# Altium schematic sheet [3] Power Supply.SchDoc: ARS Camera REV01 Power Supply
size A4; DrawnBy: Manh Ngo Van; Engineer: Manh Ngo Van; Organization: Altium Limited; Address1: L3, 12a Rodborough Rd; Address2: Frenchs Forest; Address3: NSW; Address4: Australia 2086; DocumentNumber: 3; Revision: 1.0; SheetNumber: 3; SheetTotal: 16
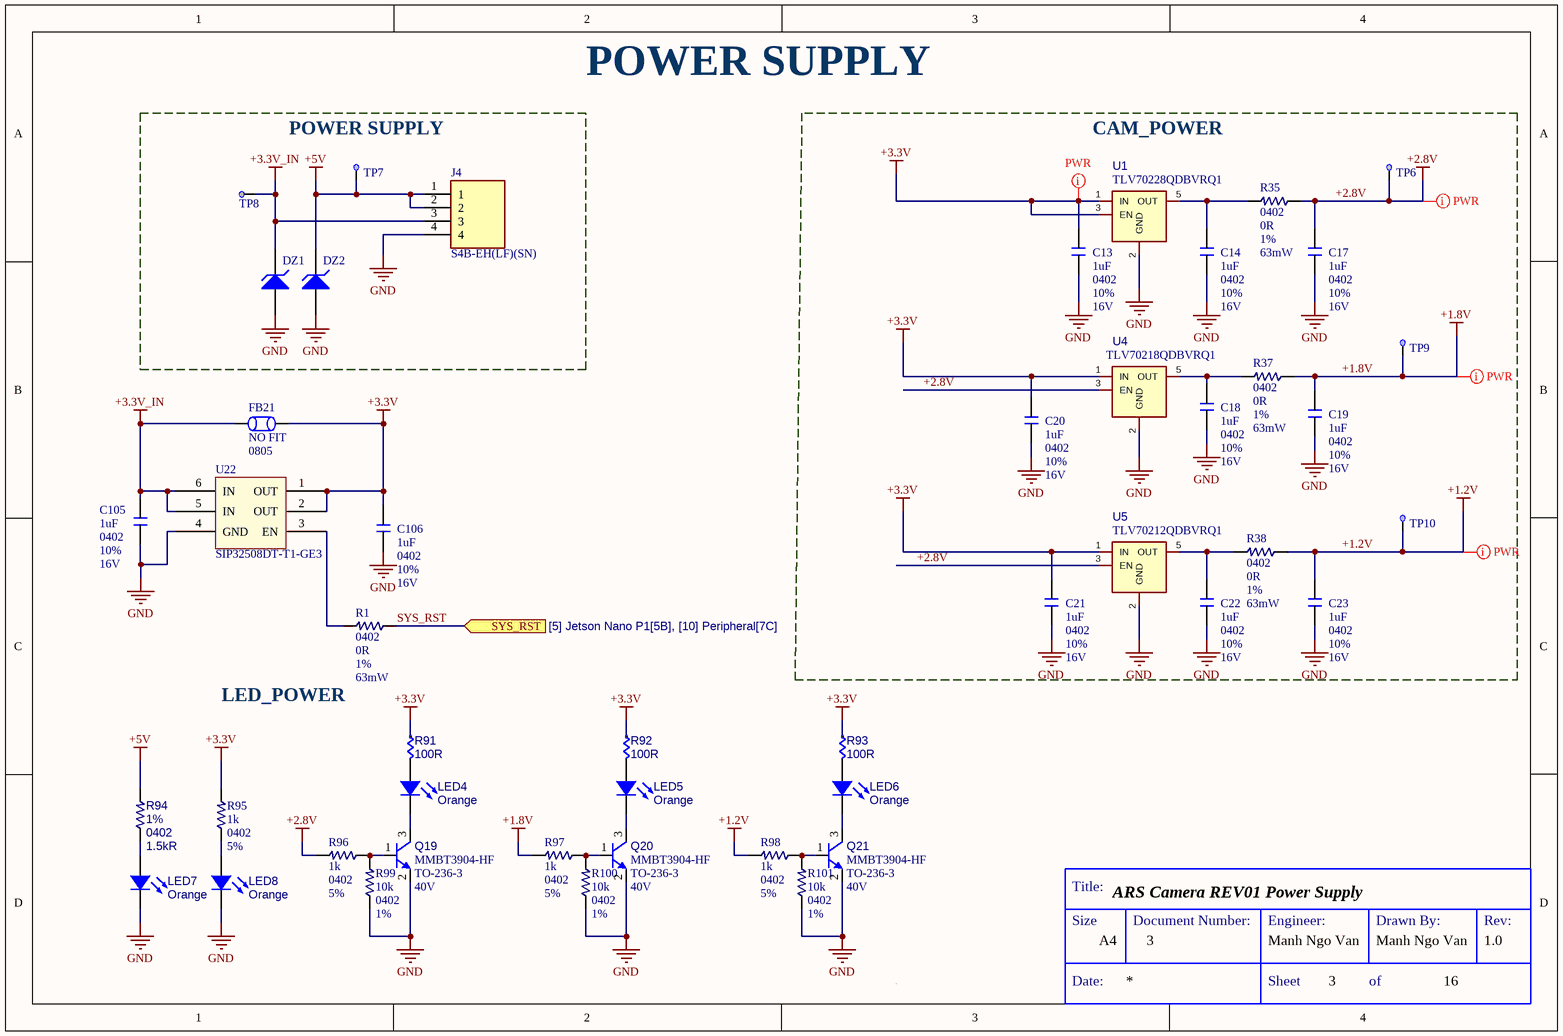
[diagram p0: [3] Power Supply.SchDoc]

## Parts
C13  1uF  Case Code (Imperial): 0402  Tolerance: 10%  Voltage: 16V  [C0402M]
C14  1uF  Case Code (Imperial): 0402  Tolerance: 10%  Voltage: 16V  [C0402M]
C17  1uF  Case Code (Imperial): 0402  Tolerance: 10%  Voltage: 16V  [C0402M]
C18  1uF  Case Code (Imperial): 0402  Tolerance: 10%  Voltage: 16V  [C0402M]
C19  1uF  Case Code (Imperial): 0402  Tolerance: 10%  Voltage: 16V  [C0402M]
C20  1uF  Case Code (Imperial): 0402  Tolerance: 10%  Voltage: 16V  [C0402M]
C21  1uF  Case Code (Imperial): 0402  Tolerance: 10%  Voltage: 16V  [C0402M]
C22  1uF  Case Code (Imperial): 0402  Tolerance: 10%  Voltage: 16V  [C0402M]
C23  1uF  Case Code (Imperial): 0402  Tolerance: 10%  Voltage: 16V  [C0402M]
C105  1uF  Case Code (Imperial): 0402  Tolerance: 10%  Voltage: 16V  [C0402M]
C106  1uF  Case Code (Imperial): 0402  Tolerance: 10%  Voltage: 16V  [C0402M]
DZ1  TPD1E10B06DPYR  [R0402M]  (value not drawn)
DZ2  TPD1E10B06DPYR  [R0402M]  (value not drawn)
FB21  NO FIT  Case Code (Imperial): 0805  [R0805M_NO_3D]
J4  S4B-EH(LF)(SN)  [S4B-EH(LF)(SN)_1]
LED4  Color: Orange  [LED-0603 - TLMO1000-GS08]  (hidden comment: TLMO1000-GS08)
LED5  Color: Orange  [LED-0603 - TLMO1000-GS08]  (hidden comment: TLMO1000-GS08)
LED6  Color: Orange  [LED-0603 - TLMO1000-GS08]  (hidden comment: TLMO1000-GS08)
LED7  Color: Orange  [LED-0603 - TLMO1000-GS08]  (hidden comment: TLMO1000-GS08)
LED8  Color: Orange  [LED-0603 - TLMO1000-GS08]  (hidden comment: TLMO1000-GS08)
Q19  Manufacturer Part Number 1: MMBT3904-HF  Case/Package: TO-236-3  Collector Emitter Breakdown Voltage: 40V  [SOT55P160X90-3N]  (hidden comment: NPN)
Q20  Manufacturer Part Number 1: MMBT3904-HF  Case/Package: TO-236-3  Collector Emitter Breakdown Voltage: 40V  [SOT55P160X90-3N]  (hidden comment: NPN)
Q21  Manufacturer Part Number 1: MMBT3904-HF  Case/Package: TO-236-3  Collector Emitter Breakdown Voltage: 40V  [SOT55P160X90-3N]  (hidden comment: NPN)
R1  Case Code (Imperial): 0402  Resistance: 0R  Tolerance: 1%  Max Power Dissipation: 63mW  [R0402M]  (hidden comment: RC0402FR-070RL)
R35  Case Code (Imperial): 0402  Resistance: 0R  Tolerance: 1%  Max Power Dissipation: 63mW  [R0402M]  (hidden comment: RC0402FR-070RL)
R37  Case Code (Imperial): 0402  Resistance: 0R  Tolerance: 1%  Max Power Dissipation: 63mW  [R0402M]  (hidden comment: RC0402FR-070RL)
R38  Case Code (Imperial): 0402  Resistance: 0R  Tolerance: 1%  Max Power Dissipation: 63mW  [R0402M]  (hidden comment: RC0402FR-070RL)
R91  Resistance: 100R  [RES0603]  (hidden comment: RC0603JR-07100RL)
R92  Resistance: 100R  [RES0603]  (hidden comment: RC0603JR-07100RL)
R93  Resistance: 100R  [RES0603]  (hidden comment: RC0603JR-07100RL)
R94  Tolerance: 1%  Case/Package: 0402  Resistance: 1.5kR  [R0402M]  (hidden comment: AC0402FR-071K5L)
R95  1k  Case Code (Imperial): 0402  Tolerance: 5%  [R0402M]
R96  1k  Case Code (Imperial): 0402  Tolerance: 5%  [R0402M]
R97  1k  Case Code (Imperial): 0402  Tolerance: 5%  [R0402M]
R98  1k  Case Code (Imperial): 0402  Tolerance: 5%  [R0402M]
R99  10k  Case Code (Imperial): 0402  Tolerance: 1%  [R0402M]
R100  10k  Case Code (Imperial): 0402  Tolerance: 1%  [R0402M]
R101  10k  Case Code (Imperial): 0402  Tolerance: 1%  [R0402M]
TP6  TP  [Test point]  (value not drawn)  (net tie, no BOM)
TP7  TP  [Test point]  (value not drawn)  (net tie, no BOM)
TP8  TP  [Test point]  (value not drawn)  (net tie, no BOM)
TP9  TP  [Test point]  (value not drawn)  (net tie, no BOM)
TP10  TP  [Test point]  (value not drawn)  (net tie, no BOM)
U1  TLV70228QDBVRQ1  [SOT95P280X145-5N]
U4  TLV70218QDBVRQ1  [SOT95P280X145-5N]
U5  TLV70212QDBVRQ1  [SOT95P280X145-5N]
U22  SIP32508DT-T1-GE3  [SOT95P280X100-6N]

## Blocks framed on the sheet
POWER SUPPLY: DZ1 DZ2 J4 TP7 TP8
CAM_POWER: C13 C14 C17-C23 R35 R37 R38 TP6 TP9 TP10 U1 U4 U5

## Ports
SYS_RST (in, see [5] Jetson Nano P1[5B], [10] Peripheral[7C])

## Nets
+1.2V: C23.1 R38.2 R98.1 TP10.1(TP)
+1.8V: C19.1 R37.2 R97.1 TP9.1(TP)
+2.8V: C17.1 R35.2 R96.1 TP6.1(TP) U4.3(EN) U5.3(EN)
+3.3V: C13.1 C20.1 C21.1 C106.1 FB21.1 R91.1 R92.1 R93.1 R95.1 U1.1(IN) U1.3(EN) U4.1(IN) U5.1(IN) U22.1(OUT) U22.2(OUT)
+3.3V_IN: C105.1 DZ1.2(K) FB21.2 J4.3 TP8.1(TP) U22.5(IN) U22.6(IN)
+5V: DZ2.2(K) J4.1 J4.2 R94.1 TP7.1(TP)
GND: C13.2 C14.2 C17.2 C18.2 C19.2 C20.2 C21.2 C22.2 C23.2 C105.2 C106.2 DZ1.1(A) DZ2.1(A) J4.4 LED7.2(K) LED8.2(K) Q19.2(E) Q20.2(E) Q21.2(E) R99.2 R100.2 R101.2 U1.2(GND) U4.2(GND) U5.2(GND) U22.4(GND)
SYS_RST: R1.2 ; port SYS_RST
NetC14_1: C14.1 R35.1 U1.5(OUT)
NetC18_1: C18.1 R37.1 U4.5(OUT)
NetC22_1: C22.1 R38.1 U5.5(OUT)
NetLED4_1: LED4.1(A) R91.2
NetLED4_2: LED4.2(K) Q19.3(C)
NetLED5_1: LED5.1(A) R92.2
NetLED5_2: LED5.2(K) Q20.3(C)
NetLED6_1: LED6.1(A) R93.2
NetLED6_2: LED6.2(K) Q21.3(C)
NetLED7_1: LED7.1(A) R94.2
NetLED8_1: LED8.1(A) R95.2
NetQ19_1: Q19.1(B) R96.2 R99.1
NetQ20_1: Q20.1(B) R97.2 R100.1
NetQ21_1: Q21.1(B) R98.2 R101.1
NetR1_1: R1.1 U22.3(EN)

Not connected (* = marked no-connect by the designer): U1 4(NC); U4 4(NC); U5 4(NC)

## Layout directives
net class PWR: +1.2V, +1.8V, +2.8V, +3.3V

## Notes on the sheet
- POWER SUPPLY
- LED_POWER
- Title:
- Size
- Document Number:
- Engineer:
- Drawn By:
- Rev:
- Date:
- A4
- Sheet
- of

## Library data of the parts
C13 C14 C17-C23 C105 C106 = CAP_CER: SAMSUNG ELECTRO-MECHANICS - CL05A105KO5NNNC - SMD Multilayer Ceramic Capacitor, 1 µF, 16 V, 0402 [1005 Metric], ± 10%, X5R, CL Series; Supplier 1: Digi-Key; Supplier Part Number 1: 1276-1067-1-ND; Manufacturer 1: Samsung; Manufacturer Part Number 1: CL05A105KO5NNNC; Stock 1: 1039902; Pricing 1: 1=0.10000, 10=0.04600, 50=0.02520, 100=0.02050, 500=0.01466, 1000=0.01151, 2500=0.01046, 5000=0.00963 (USD); RoHS: Yes; Mount: Surface Mount; Case/Package: 0402; Case Code (Metric): 1005; Contact Plating: Tin; Min Operating Temperature: -55°C; Max Operating Temperature: 85°C; Capacitance: 1uF; Dielectric: X5R; Packaging: Tape and Reel; Package Quantity: 1; Voltage Rating: 16V; Series: CL; Construction: Flat; Length: 1mm; Width: 0.02inch; Height: 0.5mm; Thickness: 0.022inch; Depth: 0.5mm; Radiation Hardening: No; RoHS Compliant: Yes; ComponentLink1URL: https://datasheet.ciiva.com/16207/cl05a105ko5nnnc-16207571.pdf?src-supplier=Future+Electronics; ComponentLink1Description: https://datasheet.ciiva.com/16207/cl05a105ko5nnnc-16207571.pdf?src-supplier=Future+Electronics; ComponentLink2URL: https://datasheet.ciiva.com/15195/getdatasheetpartid-355272-15195629.pdf?src-supplier=Verical; ComponentLink2Description: https://datasheet.ciiva.com/15195/getdatasheetpartid-355272-15195629.pdf?src-supplier=Verical
DZ1 DZ2 = D Zener: TVS DIODE 5.5V 14V 2X1SON; Manufacturer: Texas Instruments; Capacitance: 12pF; Direction: Bidirectional; Breakdown Voltage: 6V; Number of Channels: 1; Peak Pulse Power: 90W; Power Line Protection: No; Leakage Current: 100nA; ESD Protection: Yes; Test Current: 1mA; Element Configuration: Single; Peak Pulse Current: 5A; Interface: GPIO; Supplier 1: Digi-Key; Supplier Part Number 1: 296-30406-1-ND; Manufacturer Part Number: TPD1E10B06DPYR; Stock 1: 555750; Pricing 1: 1 = 0.45000, 10 = 0.29400, 100 = 0.16380, 500 = 0.10920, 1000 = 0.07560, 5000 = 0.07350 (USD); RoHS: Yes; Case/Package: 0402; Number of Pins: 2; Contact Plating: Gold; Min Operating Temperature: -40°C; Max Operating Temperature: 125°C; Package Quantity: 1; Packaging: Tape and Reel; Number of Bidirectional Channels: 1; Reverse Standoff Voltage: 5.5V; Min Breakdown Voltage: 6V; Clamping Voltage: 14V; Working Voltage: 5.5V; Max Reverse Leakage Current: 100nA; Resistor Type: Zener; Length: 1.1mm; Height: 0.35mm; Width: 0.7mm; Radiation Hardening: No; REACH SVHC: No SVHC; Lead Free: Lead Free; ComponentLink1URL: https://datasheet.ciiva.com/26005/sllseb1b-26005840.pdf?src-supplier=Avnet+Europe; ComponentLink1Description: https://datasheet.ciiva.com/26005/sllseb1b-26005840.pdf?src-supplier=Avnet+Europe; ComponentLink2URL: https://datasheet.ciiva.com/46384/1877100-46384054.pdf?src-supplier=Element14; ComponentLink2Description: https://datasheet.ciiva.com/46384/1877100-46384054.pdf?src-supplier=Element14; ComponentLink3URL: https://datasheet.ciiva.com/14195/tpd1e10b06-14195178.pdf?src-supplier=Avnet; ComponentLink3Description: https://datasheet.ciiva.com/14195/tpd1e10b06-14195178.pdf?src-supplier=Avnet; ComponentLink4URL: https://datasheet.ciiva.com/22691/1877100-22691786.pdf?src-supplier=Element14; ComponentLink4Description: https://datasheet.ciiva.com/22691/1877100-22691786.pdf?src-supplier=Element14; ComponentLink5URL: https://datasheet.ciiva.com/2961/tpd1e10b06-2961245.pdf?src-supplier=Digi-Key; ComponentLink5Description: https://datasheet.ciiva.com/2961/tpd1e10b06-2961245.pdf?src-supplier=Digi-Key; ComponentLink6URL: https://datasheet.ciiva.com/2961/tpd1e10b06-2961246.pdf?src-supplier=Digi-Key; ComponentLink6Description: https://datasheet.ciiva.com/2961/tpd1e10b06-2961246.pdf?src-supplier=Digi-Key; ComponentLink7URL: https://datasheet.ciiva.com/6574/tpd1e10b06-6574654.pdf?src-supplier=Digi-Key; ComponentLink7Description: https://datasheet.ciiva.com/6574/tpd1e10b06-6574654.pdf?src-supplier=Digi-Key
FB21 = FB: TAIYO YUDEN - BKP2125HS600-T - Ferrite Bead, 0805 [2012 Metric], 60 ohm, 3 A, BKP Series, 0.025 ohm, ± 25%; Impedance: 60R; DC Resistance (DCR): 25mR; Test Frequency: 100MHz; Max Current Rating: 3A; Number of Lines: 1; Shielding: Unshielded; Supplier 1: Digi-Key; Supplier Part Number 1: 587-1932-1-ND; Manufacturer 1: Taiyo Yuden; Manufacturer Part Number 1: BKP2125HS600-T; Stock 1: 181157; Pricing 1: 1=0.12000, 10=0.09400, 25=0.08480, 50=0.06200, 100=0.05360, 250=0.04232, 500=0.03574, 1000=0.03010 (USD); RoHS: Yes; Mount: Surface Mount; Case/Package: 0805; Number of Pins: 2; Core Material: Ferrite; Case Code (Metric): 2125; Min Operating Temperature: -55°C; Max Operating Temperature: 85°C; Tolerance: 25%; Packaging: Tape and Reel; Package Quantity: 1; Termination: SMD/SMT; Resistance: 25mR; Series: BK; Length: 2.3mm; Width: 0.049inch; Height: 1.05mm; Depth: 1.45mm; RoHS Compliant: Yes; Lead Free: Lead Free; Halogen Free: Halogen Free; REACH SVHC: Unknown; ComponentLink1URL: https://datasheet.ciiva.com/6213/bkp2125hs600-t-ss-6213090.pdf?src-supplier=Digi-Key; ComponentLink1Description: https://datasheet.ciiva.com/6213/bkp2125hs600-t-ss-6213090.pdf?src-supplier=Digi-Key; ComponentLink2URL: https://datasheet.ciiva.com/30063/884bkp2125hs600-t-30063956.pdf?src-supplier=Onlinecomponents.com; ComponentLink2Description: https://datasheet.ciiva.com/30063/884bkp2125hs600-t-30063956.pdf?src-supplier=Onlinecomponents.com; ComponentLink3URL: https://datasheet.ciiva.com/6213/mlci08-e-6213094.pdf?src-supplier=Digi-Key; ComponentLink3Description: https://datasheet.ciiva.com/6213/mlci08-e-6213094.pdf?src-supplier=Digi-Key; ComponentLink4URL: https://datasheet.ciiva.com/6213/mlci08-e-6213097.pdf?src-supplier=Digi-Key; ComponentLink4Description: https://datasheet.ciiva.com/6213/mlci08-e-6213097.pdf?src-supplier=Digi-Key
J4 = S4B-EH_LF__SN_: CONN HEADER R/A 4POS 2.5MM; Manufacturer: JST; Supplier 1: Digi-Key; Supplier Part Number 1: 455-1627-ND; Manufacturer Part Number: S4B-EH(LF)(SN); RoHS: Yes; Category: Headers and Wire Housings; ComponentLink1URL: https://datasheet.ciiva.com/712/eeh-712458.pdf?src-supplier=Digi-Key; ComponentLink1Description: https://datasheet.ciiva.com/712/eeh-712458.pdf?src-supplier=Digi-Key
LED4-LED8 = LED TLMO1000-GS08: LED ORANGE 0603 SMD; Manufacturer: Vishay; Forward Voltage: 1.8V; Luminous Intensity: 7.5mcd; Viewing Angle: 160°; Wavelength: 609nm; Lens Style: Rectangular; Dominant Wavelength: 605nm; Power Dissipation: 40mW; Number of LEDs: 1; Forward Current: 2mA; Reverse Voltage: 6V; Supplier 1: Digi-Key; Manufacturer Part Number: TLMO1000-GS08; RoHS: Yes; Category: LEDs; Stock 1: 42879; Pricing 1: 1=0.46000, 10=0.28400, 100=0.16350, 1000=0.12793 (USD); Mount: Surface Mount; Case/Package: 0603; Number of Pins: 2; Case Code (Metric): 1608; Case Code (Imperial): 0603; Min Operating Temperature: -40°C; Max Operating Temperature: 100°C; Packaging: Tape and Reel; Illumination Color: Orange; Power Rating: 40mW; Package Quantity: 3000; Test Current: 2mA; Number of Elements: 1; Max Power Dissipation: 40mW; Length: 1.6mm; Width: 0.8mm; Height: 0.6mm; Depth: 0.8mm; Radiation Hardening: No; REACH SVHC: Unknown; Lead Free: Lead Free; Supplier Part Number 1: TLMO1000-GS08CT-ND
Q19-Q21 = NPN: TRANS NPN 40V 0.2A SOT523; Manufacturer 1: Comchip; Collector Emitter Voltage (VCEO): 300mV; Max Collector Current: 200mA; Max Power Dissipation: 200mW; Transition Frequency: 300MHz; Element Configuration: Single; Collector Base Voltage (VCBO): 60V; Emitter Base Voltage (VEBO): 6V; Supplier 1: Digi-Key; Supplier Part Number 1: 641-1683-1-ND; Stock 1: 63354; Pricing 1: 1=0.19000, 10=0.17600, 100=0.09590, 500=0.05900, 1000=0.04023 (USD); RoHS: Yes; Mount: Surface Mount; Min Operating Temperature: -55°C; Max Operating Temperature: 150°C; Packaging: Tape and Reel; Package Quantity: 3000; Polarity: NPN; Collector Emitter Saturation Voltage: 300mV; Gain Bandwidth Product: 300MHz; Continuous Collector Current: 200mA; Collector-emitter Voltage-Max: 300mV; Series: -; Max Breakdown Voltage: 40V; RoHS Compliant: Yes; ComponentLink1URL: https://datasheet.ciiva.com/12075/mmbt3904-hf20reva265354-44540-12075939.pdf?src-supplier=Mouser; ComponentLink1Description: https://datasheet.ciiva.com/12075/mmbt3904-hf20reva265354-44540-12075939.pdf?src-supplier=Mouser; ComponentLink2URL: https://datasheet.ciiva.com/2957/mmbt3904-hf20reva265354-2957612.pdf?src-supplier=Digi-Key; ComponentLink2Description: https://datasheet.ciiva.com/2957/mmbt3904-hf20reva265354-2957612.pdf?src-supplier=Digi-Key
R1 R35 R37 R38 = RES_SMD: RC Series 0402 0.063 W 0 Ohm Jumper Surface Mount Thick Film Chip Resistor; Manufacturer 1: Yageo; Power Rating: 62.5mW; Voltage Rating: 50V; Temperature Coefficient: 200ppm/°C; Supplier 1: Digi-Key; Supplier Part Number 1: 311-0.0LRCT-ND; Manufacturer Part Number 1: RC0402FR-070RL; Stock 1: 2177900; Pricing 1: 1=0.10000, 10=0.01200, 25=0.00840, 50=0.00640, 100=0.00470, 250=0.00360, 500=0.00288, 1000=0.00212, 5000=0.00152 (USD); RoHS: Yes; Mount: Surface Mount; Case/Package: 0402; Contact Plating: Tin,Matte; Case Code (Metric): 1005; Size Code: 0402; Min Operating Temperature: -55°C; Max Operating Temperature: 155°C; Resistor Type: Thick Film; Packaging: Tape and Reel; Termination: SMD/SMT; Features: Moisture Resistant; Series: RC; Number of Terminations: 2; Length: 1mm; Width: 0.5mm; Height: 0.35mm; Radiation Hardening: No; Lead Free: Lead Free; RoHS Compliant: Yes; ComponentLink1URL: https://datasheet.ciiva.com/8896/pyu-rc0402-51-rohs-l-6-8896149.pdf?src-supplier=Avnet; ComponentLink1Description: https://datasheet.ciiva.com/8896/pyu-rc0402-51-rohs-l-6-8896149.pdf?src-supplier=Avnet; ComponentLink2URL: https://datasheet.ciiva.com/16790/pyu-rc0402-51-rohs-l-6-r-16790444.pdf?src-supplier=Future+Electronics; ComponentLink2Description: https://datasheet.ciiva.com/16790/pyu-rc0402-51-rohs-l-6-r-16790444.pdf?src-supplier=Future+Electronics; ComponentLink3URL: https://datasheet.ciiva.com/28419/pyu-rc0402-51-rohs-l-6-28419661.pdf?src-supplier=Avnet+Europe; ComponentLink3Description: https://datasheet.ciiva.com/28419/pyu-rc0402-51-rohs-l-6-28419661.pdf?src-supplier=Avnet+Europe; ComponentLink4URL: https://datasheet.ciiva.com/16869/pyu-rc0402-51-rohs-l-6-16869518.pdf?src-supplier=Avnet+Europe; ComponentLink4Description: https://datasheet.ciiva.com/16869/pyu-rc0402-51-rohs-l-6-16869518.pdf?src-supplier=Avnet+Europe
R91-R93 = CMP-01437-7: RES SMD 100 OHM 5% 1/10W 0603; Manufacturer 1: Yageo; Description 1: RES CHP 100R 5% 1/10W 0603 SMD; Voltage Rating: 50V; PHX PN 1: RESCHP0053; Type 1: Ep; Temperature Coefficient: 100ppm/°C; Line 1: SMT; Unit 1: Pcs; Class 1: B; Comment 1: 100R 0603; Max Power Dissipation: 100mW; Vendor PN 1: Sunka-VSR-0603-100R-J; PHX CODE 1: 100800059; Mount 1: SMD; Size Code: 0603; Features: Moisture Resistant; Resistance Tolerance: 5%; Construction: Rectangular; Number of Pins: 2; Voltage Rating (DC): 50V; Case/Package: 0603; Resistor Type: Thick Film; Tolerance: 5%; Case Code (Imperial): 0603; Min Operating Temperature: -55°C; Depth: 0.8mm; Military Standard: Not; Radiation Hardening: No; Termination: SMD/SMT; Packaging: Tape and Reel; Lead Free: Lead Free; Case Code (Metric): 1608; Width: 0.8mm; Contact Plating: Tin,Matte; Manufacturer Part Number 1: RC0603JR-07100RL; Length: 1.6mm; Number of Terminations: 2; Series: RC; REACH SVHC: Unknown; Max Operating Temperature: 155°C; Power Rating: 100mW
R94 = RES_SMD_1.5K: RES SMD 1.5K OHM 1% 1/16W 0402; Manufacturer: Yageo; Power Rating: 62.5mW; Voltage Rating: 50V; Max Power Dissipation: 63mW; Temperature Coefficient: 100ppm/°C; Supplier 1: Digi-Key; Manufacturer Part Number: AC0402FR-071K5L; RoHS: Yes; Category: Chip SMD Resistors; Stock 1: 632736; Pricing 1: 1=0.10000, 10=0.02000, 100=0.00830, 1000=0.00371, 2500=0.00322, 5000=0.00266 (USD); Mount: Surface Mount; Case Code (Imperial): 0402; Case Code (Metric): 1005; Size Code: 0402; Min Operating Temperature: -55°C; Max Operating Temperature: 155°C; Packaging: Tape and Reel; Resistor Type: Thick Film; Number of Terminations: 2; Termination: SMD/SMT; Features: Moisture Resistant,Automotive AEC-Q200; Series: AC; Length: 0.039inch; Width: 0.02inch; Height: 0.015inch; Lead Free: Lead Free; RoHS Compliant: Yes; ComponentLink1URL: http://www.mouser.com/ds/2/447/yageodocoutput-1111992.pdf?src-supplier=Mouser; ComponentLink1Description: http://www.mouser.com/ds/2/447/yageodocoutput-1111992.pdf?src-supplier=Mouser; ComponentLink2URL: http://www.yageo.com/documents/recent/PYu-AC_51_RoHS_L_2_revised.pdf?src-supplier=Future+Electronics; ComponentLink2Description: http://www.yageo.com/documents/recent/PYu-AC_51_RoHS_L_2_revised.pdf?src-supplier=Future+Electronics; ComponentLink3URL: http://www.yageo.com/NewPortal/yageodocoutput?fileName=/pdf/R-Chip/PYu-AC_51_RoHS_L_6.pdf&src-supplier=Digi-Key; ComponentLink3Description: http://www.yageo.com/NewPortal/yageodocoutput?fileName=/pdf/R-Chip/PYu-AC_51_RoHS_L_6.pdf&src-supplier=Digi-Key; Supplier Part Number 1: YAG3448CT-ND
R95-R98 = RES_SMD: RES SMD 1K OHM 5% 1/16W 0402; Manufacturer: Yageo; Manufacturer Part Number: RC0402JR-071KL; Resistance: 1kR; Power Rating: 62.5mW; Voltage Rating: 50V; Temperature Coefficient: 100ppm/°C; Max Power Dissipation: 63mW; ComponentLink1URL: https://datasheet.ciiva.com/16855/pyu-rc0201-51-rohs-l-8-16855270.pdf?src-supplier=Avnet+Europe; ComponentLink1Description: https://datasheet.ciiva.com/16855/pyu-rc0201-51-rohs-l-8-16855270.pdf?src-supplier=Avnet+Europe; ComponentLink2URL: https://datasheet.ciiva.com/7672/1563626-7672265.pdf?src-supplier=Element14; ComponentLink2Description: https://datasheet.ciiva.com/7672/1563626-7672265.pdf?src-supplier=Element14; ComponentLink3URL: https://datasheet.ciiva.com/7660/1421516-7660811.pdf?src-supplier=Element14; ComponentLink3Description: https://datasheet.ciiva.com/7660/1421516-7660811.pdf?src-supplier=Element14; ComponentLink4URL: https://datasheet.ciiva.com/46391/1421516-46391293.pdf?src-supplier=Element14; ComponentLink4Description: https://datasheet.ciiva.com/46391/1421516-46391293.pdf?src-supplier=Element14; ComponentLink5URL: https://datasheet.ciiva.com/2462/pyu-r-int-thick-7-2462830.pdf?src-supplier=Digi-Key; ComponentLink5Description: https://datasheet.ciiva.com/2462/pyu-r-int-thick-7-2462830.pdf?src-supplier=Digi-Key; ComponentLink6URL: https://datasheet.ciiva.com/2462/pyu-r-int-thick-7-2462831.pdf?src-supplier=Digi-Key; ComponentLink6Description: https://datasheet.ciiva.com/2462/pyu-r-int-thick-7-2462831.pdf?src-supplier=Digi-Key; ComponentLink7URL: https://datasheet.ciiva.com/8896/pyu-rc0201-51-rohs-l-8-8896175.pdf?src-supplier=Avnet; ComponentLink7Description: https://datasheet.ciiva.com/8896/pyu-rc0201-51-rohs-l-8-8896175.pdf?src-supplier=Avnet; ComponentLink8URL: https://datasheet.ciiva.com/28419/pyu-rc0201-51-rohs-l-8-28419638.pdf?src-supplier=Avnet+Europe; ComponentLink8Description: https://datasheet.ciiva.com/28419/pyu-rc0201-51-rohs-l-8-28419638.pdf?src-supplier=Avnet+Europe; ComponentLink9URL: https://datasheet.ciiva.com/7672/1563626-7672264.pdf?src-supplier=Element14; ComponentLink9Description: https://datasheet.ciiva.com/7672/1563626-7672264.pdf?src-supplier=Element14; ComponentLink10URL: https://datasheet.ciiva.com/2462/pyu-r-int-thick-7-2462829.pdf?src-supplier=Digi-Key; ComponentLink10Description: https://datasheet.ciiva.com/2462/pyu-r-int-thick-7-2462829.pdf?src-supplier=Digi-Key; Supplier 1: Digi-Key; Supplier Part Number 1: 311-1.0KJRCT-ND; Stock 1: 0; Pricing 1: 1 = 0.10000, 10 = 0.01300, 100 = 0.00530, 1000 = 0.00236, 2500 = 0.00205, 5000 = 0.00169 (USD); RoHS: Yes; Case/Package: 0402; Case Code (Metric): 1005; Min Operating Temperature: -55°C; Max Operating Temperature: 155°C; Packaging: Tape and Reel; Package Quantity: 1; Termination: SMD/SMT; Composition: Thick Film; Number of Terminations: 2; Military Standard: Not; Features: Moisture Resistant; Length: 0.039inch; Height: 0.016inch; Width: 0.02inch; Depth: 0.5mm; REACH SVHC: No SVHC; Lead Free: Lead Free; ComponentLink11URL: https://datasheet.ciiva.com/2452/pyu-r-int-thick-7-2452755.pdf?src-supplier=Digi-Key; ComponentLink11Description: https://datasheet.ciiva.com/2452/pyu-r-int-thick-7-2452755.pdf?src-supplier=Digi-Key; ComponentLink12URL: https://datasheet.ciiva.com/2452/pyu-r-int-thick-7-2452756.pdf?src-supplier=Digi-Key; ComponentLink12Description: https://datasheet.ciiva.com/2452/pyu-r-int-thick-7-2452756.pdf?src-supplier=Digi-Key; ComponentLink13URL: https://datasheet.ciiva.com/2452/pyu-r-int-thick-7-2452757.pdf?src-supplier=Digi-Key; ComponentLink13Description: https://datasheet.ciiva.com/2452/pyu-r-int-thick-7-2452757.pdf?src-supplier=Digi-Key; ComponentLink14URL: https://datasheet.ciiva.com/7983/1018594-7983558.pdf?src-supplier=Element14; ComponentLink14Description: https://datasheet.ciiva.com/7983/1018594-7983558.pdf?src-supplier=Element14; ComponentLink15URL: https://datasheet.ciiva.com/7850/1018594-7850170.pdf?src-supplier=Element14; ComponentLink15Description: https://datasheet.ciiva.com/7850/1018594-7850170.pdf?src-supplier=Element14; ComponentLink16URL: https://datasheet.ciiva.com/7850/1018594-7850171.pdf?src-supplier=Element14; ComponentLink16Description: https://datasheet.ciiva.com/7850/1018594-7850171.pdf?src-supplier=Element14; ComponentLink17URL: https://datasheet.ciiva.com/17081/pyu-rc0402-51-rohs-l-6-r-17081438.pdf?src-supplier=Future+Electronics; ComponentLink17Description: https://datasheet.ciiva.com/17081/pyu-rc0402-51-rohs-l-6-r-17081438.pdf?src-supplier=Future+Electronics
R99-R101 = RES_SMD: RES SMD 10K OHM 1% 1/16W 0402; Manufacturer: Yageo; Manufacturer Part Number: RC0402FR-0710KL; Resistance: 10kR; Temperature Coefficient: 100ppm/°C; Voltage Rating (DC): 50V; Power Rating: 62.5mW; Supplier 1: Digi-Key; Supplier Part Number 1: 311-10.0KLRTR-ND; Stock 1: 58760000; Pricing 1: 10000 = 0.001630, 30000 = 0.001440, 50000 = 0.001320, 100000 = 0.001290 (USD); RoHS: Yes; Case/Package: 0402; Number of Pins: 2; Case Code (Metric): 1005; Min Operating Temperature: -55°C; Max Operating Temperature: 155°C; Composition: Thick Film; Packaging: Tape and Reel; Voltage Rating: 50V; Termination: SMD/SMT; Military Standard: Not; Working Voltage: 50V; Number of Terminations: 2; Length: 1mm; Height: 0.32mm; Width: 0.5mm; Depth: 0.5mm; Lead Pitch: 0.2mm; REACH SVHC: No SVHC; Lead Free: Lead Free; ComponentLink1URL: https://datasheet.ciiva.com/7660/38568-7660787.pdf?src-supplier=Element14; ComponentLink1Description: https://datasheet.ciiva.com/7660/38568-7660787.pdf?src-supplier=Element14; ComponentLink2URL: https://datasheet.ciiva.com/7849/1784430-7849813.pdf?src-supplier=Element14; ComponentLink2Description: https://datasheet.ciiva.com/7849/1784430-7849813.pdf?src-supplier=Element14; ComponentLink3URL: https://datasheet.ciiva.com/7849/1686128-7849814.pdf?src-supplier=Element14; ComponentLink3Description: https://datasheet.ciiva.com/7849/1686128-7849814.pdf?src-supplier=Element14; ComponentLink4URL: https://datasheet.ciiva.com/7849/1784430-7849815.pdf?src-supplier=Element14; ComponentLink4Description: https://datasheet.ciiva.com/7849/1784430-7849815.pdf?src-supplier=Element14; ComponentLink5URL: https://datasheet.ciiva.com/22747/1018594-22747512.pdf?src-supplier=Element14; ComponentLink5Description: https://datasheet.ciiva.com/22747/1018594-22747512.pdf?src-supplier=Element14; ComponentLink6URL: https://datasheet.ciiva.com/12667/pyu-rc0402-51-rohs-l-6-r-12667067.pdf?src-supplier=Mouser; ComponentLink6Description: https://datasheet.ciiva.com/12667/pyu-rc0402-51-rohs-l-6-r-12667067.pdf?src-supplier=Mouser; ComponentLink7URL: https://datasheet.ciiva.com/7983/1018594-7983486.pdf?src-supplier=Element14; ComponentLink7Description: https://datasheet.ciiva.com/7983/1018594-7983486.pdf?src-supplier=Element14
TP6-TP10 = TestPoint
U1 = TLV70228QDBVRQ1: LDO Regulator Pos 2.8V 0.3A Automotive 5-Pin SOT-23 T/R; Manufacturer 1: Texas Instruments; Supplier 1: Arrow Electronics; Manufacturer Part Number 1: TLV70228QDBVRQ1; Stock 1: 846; Pricing 1: 1=0.66490, 10=0.55480, 25=0.54940, 100=0.41110, 250=0.36210, 500=0.32440 (USD); RoHS: Yes; RoHS Compliant: Yes; ComponentLink1URL: http://www.ti.com/general/docs/suppproductinfo.tsp?distId=10&amp;gotoUrl=http%3A%2F%2Fwww.ti.com%2Flit%2Fgpn%2Ftlv702-q1&src-supplier=Digi-Key; ComponentLink1Description: http://www.ti.com/general/docs/suppproductinfo.tsp?distId=10&amp;gotoUrl=http%3A%2F%2Fwww.ti.com%2Flit%2Fgpn%2Ftlv702-q1&src-supplier=Digi-Key; Supplier Part Number 1: TLV70228QDBVRQ1
U4 = TLV70218QDBVRQ1: LDO Regulator Pos 1.8V 0.3A Automotive 5-Pin SOT-23 T/R; Manufacturer 1: Texas Instruments; Supplier 1: Mouser; Manufacturer Part Number 1: TLV70218QDBVRQ1; Stock 1: 0; Pricing 1: 1=0.63000, 10=0.55000, 50=0.55000, 100=0.42200, 1000=0.26700, 10000=0.24200 (USD); RoHS: Yes; Min Operating Temperature: -40°C; Max Operating Temperature: 125°C; RoHS Compliant: Yes; ComponentLink1URL: http://www.ti.com/general/docs/suppproductinfo.tsp?distId=10&amp;gotoUrl=http%3A%2F%2Fwww.ti.com%2Flit%2Fgpn%2Ftlv702-q1&src-supplier=Digi-Key; ComponentLink1Description: http://www.ti.com/general/docs/suppproductinfo.tsp?distId=10&amp;gotoUrl=http%3A%2F%2Fwww.ti.com%2Flit%2Fgpn%2Ftlv702-q1&src-supplier=Digi-Key; Supplier Part Number 1: 595-TLV70218QDBVRQ1
U5 = TLV70212QDBVRQ1: LDO Regulator Pos 1.2V 0.3A Automotive 5-Pin SOT-23 T/R; Manufacturer 1: Texas Instruments; Supplier 1: Mouser; Manufacturer Part Number 1: TLV70212QDBVRQ1; Stock 1: 0; Pricing 1: 1=0.63000, 10=0.55000, 50=0.55000, 100=0.42200, 1000=0.26700, 10000=0.24200 (USD); RoHS: Yes; Min Operating Temperature: -40°C; Max Operating Temperature: 125°C; RoHS Compliant: Yes; ComponentLink1URL: http://www.ti.com/general/docs/suppproductinfo.tsp?distId=10&amp;gotoUrl=http%3A%2F%2Fwww.ti.com%2Flit%2Fgpn%2Ftlv702-q1&src-supplier=Digi-Key; ComponentLink1Description: http://www.ti.com/general/docs/suppproductinfo.tsp?distId=10&amp;gotoUrl=http%3A%2F%2Fwww.ti.com%2Flit%2Fgpn%2Ftlv702-q1&src-supplier=Digi-Key; Supplier Part Number 1: 595-TLV70212QDBVRQ1
U22 = SIP32508DT-T1-GE3: Power Switch ICs - Power Distribution Slew Rate Controlled Load Switch; Manufacturer 1: Vishay / Siliconix; Manufacturer Part Number 1: SIP32508DT-T1-GE3; Supplier 1: Mouser; Supplier Part Number 1: 78-SIP32508DT-T1-GE3